# Altium schematic sheet UART.SchDoc
size A4
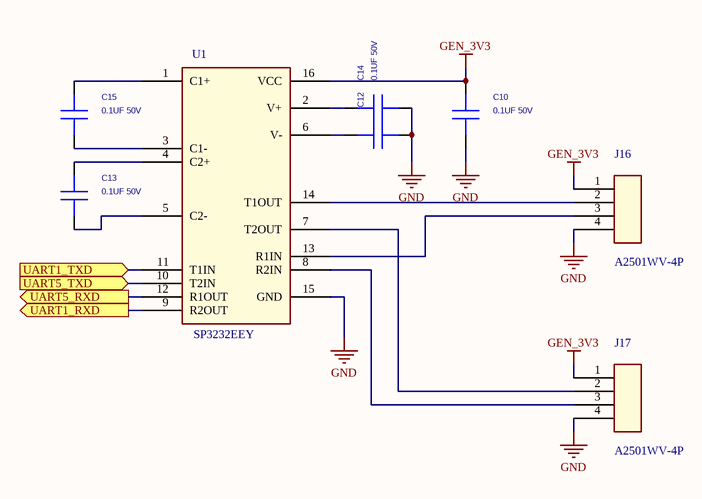
[diagram p0: UART.SchDoc]

## Parts
C10  0.1UF 50V  [SC0603]
C12  0.1UF 50V  [SC0603]  (value not drawn)
C13  0.1UF 50V  [SC0603]
C14  0.1UF 50V  [SC0603]
C15  0.1UF 50V  [SC0603]
J16  A2501WV-4P  [A2501WV-4P]
J17  A2501WV-4P  [A2501WV-4P]
U1  SP3232EEY  [TSSOP16-0P65-5P1X4P5]

## Ports
UART1_RXD (out), UART1_TXD (in), UART5_RXD (out), UART5_TXD (in)

## Nets
GEN_3V3: C10.1 J16.1 J17.1 U1.16(VCC)
GND: C10.2 C12.2 C14.2 J16.4 J17.4 U1.15(GND)
UART1_RXD: U1.9(R2OUT) ; port UART1_RXD
UART1_TXD: U1.11(T1IN) ; port UART1_TXD
UART5_RXD: U1.12(R1OUT) ; port UART5_RXD
UART5_TXD: U1.10(T2IN) ; port UART5_TXD
NetC12_1: C12.1 U1.6(V-)
NetC13_1: C13.1 U1.4(C2+)
NetC13_2: C13.2 U1.5(C2-)
NetC14_1: C14.1 U1.2(V+)
NetC15_1: C15.1 U1.1(C1+)
NetC15_2: C15.2 U1.3(C1-)
NetJ16_2: J16.2 U1.14(T1OUT)
NetJ16_3: J16.3 U1.13(R1IN)
NetJ17_2: J17.2 U1.7(T2OUT)
NetJ17_3: J17.3 U1.8(R2IN)

## Library data of the parts
C10 C12-C15 = 0.1uF-6.3V-10%-X5R-0402: Capacitor, 0.1uF, 50V, 10%, X5R, 0603; Cost_100: 0.0184; Cost_1K: 0.01005; Dist1: Digikey; Dist1_PN: PCC2146CT-ND; Device: CAP0402; Mfg1_PN: ECJ-0EB1A104K; Mfg1: Panasonic; Voltage: 6.3V; Cost_Reel: 0.00871; Mfg2_PN: MCCJ104K0NRTF; DNP: No; Cost: 0.026; Dielectric: X5R; TOLERANCE: 10%; Mfg2: SMEC
J16 J17 = CON4